# Altium schematic sheet Altium First PCB.SchDoc
size A4; SheetNumber: 1; SheetTotal: 1
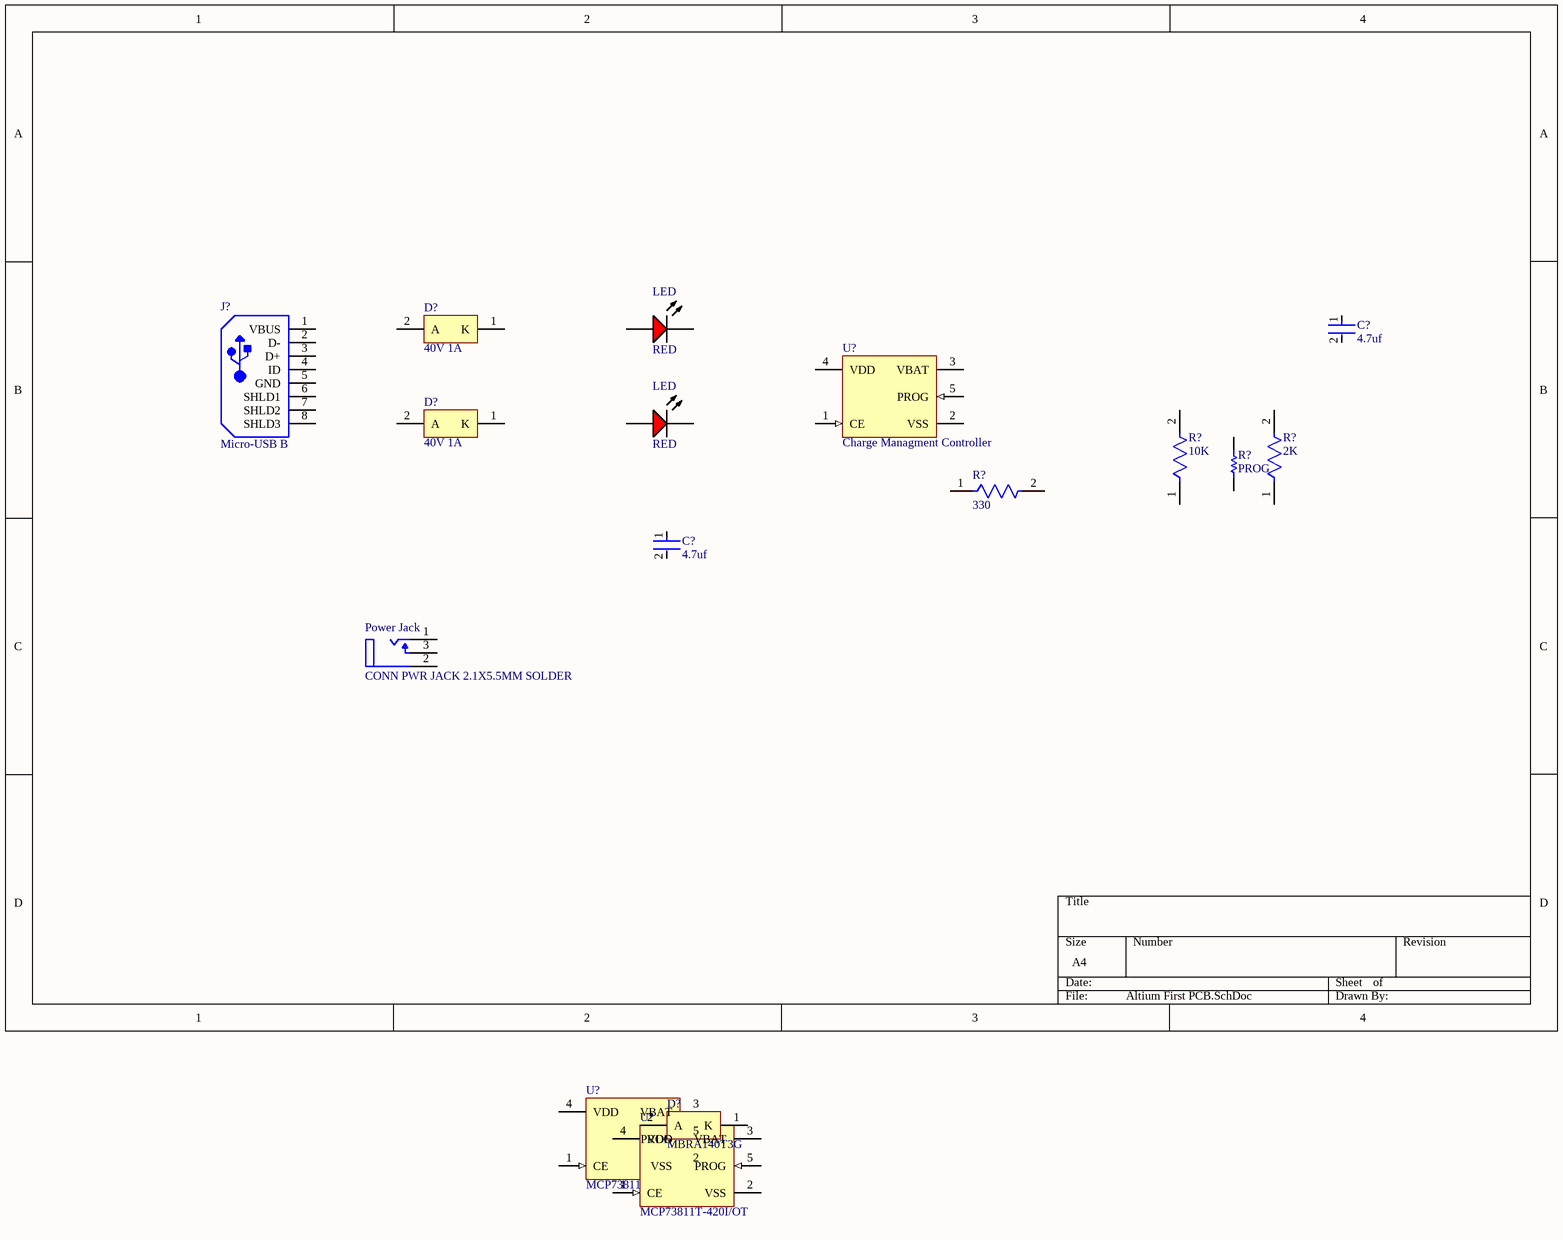
[diagram p0: Altium First PCB.SchDoc]

## Parts
(Parts that share a designator on the sheet are numbered #1, #2 ... from top to bottom, then left to right.)
C?#1  4.7uf  [FP-CC0805-0_85-MFG]
C?#2  4.7uf  [FP-CC0805-0_85-MFG]
D?#1  40V 1A  [ONSC-SMA-2-403D-02_V]
D?#2  40V 1A  [ONSC-SMA-2-403D-02_V]
D?#3  MBRA140T3G  [ONSC-SMA-2-403D-02_V]
J?  Micro-USB B  [MOLX-105133-0001_V]
LED#1  RED  [VISH-TLMS1000_V]
LED#2  RED  [VISH-TLMS1000_V]
Power_Jack  CONN PWR JACK 2.1X5.5MM SOLDER  [FP-RASM722PTR13X-MFG]
R?#1  PROG  [VISH-A1-2_V1]
R?#2  330  [FP-CRCW0805-e3-MFG]
R?#3  10K  [FP-CRCW0805-e3-IPC_C]
R?#4  2K  [FP-CRCW0805-e3-IPC_B]
U?#1  Charge Managment Controller  [SOT-23-OT5_M]
U?#2  MCP73811T-420I/OT  [SOT-23-OT5_M]
U?#3  MCP73811T-420I/OT  [SOT-23-OT5_M]

## Nets

Not connected (* = marked no-connect by the designer): C?#1 1 2; C?#2 1 2; D?#1 1(K) 2(A); D?#2 1(K) 2(A); D?#3 1(K) 2(A); J? 1(VBUS) 2(D-) 3(D+) 4(ID) 5(GND) 6(SHLD1) 7(SHLD2) 8(SHLD3); LED#1 1(A) 2(K); LED#2 1(A) 2(K); Power_Jack 1(TIP_TERMINAL(CENTER_PIN)) 2(SLEEVE_TERMINAL) 3(SHUNT_TERMINAL); R?#1 1 2; R?#2 1 2; R?#3 1 2; R?#4 1 2; U?#1 1(CE) 2(VSS) 3(VBAT) 4(VDD) 5(PROG); U?#2 1(CE) 2(VSS) 3(VBAT) 4(VDD) 5(PROG); U?#3 1(CE) 2(VSS) 3(VBAT) 4(VDD) 5(PROG)

## Library data of the parts
C?#1 C?#2 = CMP-03422-001331-1: CAP CER 4.7UF 6.3V X5R 0805; Manufacturer Part Number: CC0805KKX5R5BB475; Manufacturer: Yageo; Tolerance: 0.1; Material: Ceramic; Description: CC0805 4.7 uF X5R 10.00% 6.3 V; ComponentLink2URL: http://www.yageo.com/documents/recent/UPY-GPHC_Y5V_6.3V-to-50V_8.pdf; Octopart: https://octopart.com/cc0805kkx5r5bb475-yageo-8376548; Height: 0.95mm; Category: Cap; Ipc Land Pattern Name: CAPC200125X85; Temperature Range High: +85°C; Device Class L3: Ceramic Capacitors; Device Class L1: Passive Components; Lead Free: Yes; Temperature Characteristic: X5R; Digikey Description: CAP CER 4.7UF 6.3V X5R 0805; Footprint Url: http://www.yageo.com/exep/pages/download/literatures/UPY-C_GEN_24.pdf; Automotive: No; ComponentLink2Description: Datasheet; Temperature Range Low: -30°C; RoHS: TRUE; Value: 4.7 uF; Capacitance: 4.7 uF; Temperature: -30°C to +85°C; Mouser Description: Multilayer Ceramic Capacitors MLCC - SMD/SMT 4.7uF 6.3V X5R 10%; Package: CC0805-0.85; Device Class L2: Capacitors; Voltage Rating: 6.3 V
D?#1 D?#2 = CMP-1055-00320-1: Schottky Power Rectifier, 2-Pin SMA, Pb-Free, Tape and Reel; PartNumber: MBRA140T3G; Manufacturer: On Semiconductor; Configuration: Single; IFSM Max (A): 30; PackageReference: SMA-2-403D-02; PackageDescription: 2-Pin Small Molded Package, J-Bend Lead, Body 2.605 x 4.315 mm; RoHS: TRUE; ComponentLink1Description: Manufacturer URL; Packing: Tape and Reel; ComponentLink3URL: http://www.onsemi.com/pub_link/Collateral/403D-02.PDF; ComponentLink2Description: Datasheet; ComponentLink2URL: http://www.onsemi.cn/pub_link/Collateral/MBRA140T3-D.PDF; DatasheetVersion: Rev. 10; ComponentLink1URL: http://www.onsemi.com/; ComponentLink3Description: Package Specification; Mounting Technology: Surface Mount; PackageVersion: Rev. G, 07/2012
D?#3 = CMP-1055-00320-1: Schottky Power Rectifier, 2-Pin SMA, Pb-Free, Tape and Reel; Manufacturer: On Semiconductor; Configuration: Single; IFSM Max (A): 30; PackageReference: SMA-2-403D-02; PackageDescription: 2-Pin Small Molded Package, J-Bend Lead, Body 2.605 x 4.315 mm; RoHS: TRUE; ComponentLink1Description: Manufacturer URL; Packing: Tape and Reel; ComponentLink3URL: http://www.onsemi.com/pub_link/Collateral/403D-02.PDF; ComponentLink2Description: Datasheet; ComponentLink2URL: http://www.onsemi.cn/pub_link/Collateral/MBRA140T3-D.PDF; DatasheetVersion: Rev. 10; ComponentLink1URL: http://www.onsemi.com/; PartNumber: MBRA140T3G; ComponentLink3Description: Package Specification; Mounting Technology: Surface Mount; PackageVersion: Rev. G, 07/2012
J? = CMP-2000-05829-1: Micro-USB B Receptacle, Vertical, -30 to 85 degC, 5-Pin SMD, RoHS, Tape and Reel; Manufacturer: Molex; PartNumber: 105133-0001; Package Version: Rev. C, 11/2015; Voltage Rating: 30VAC; Connector Type: MicroUSBTypeBReceptacle; Current Rating: 1.8A; Number of Ports: 1; Voltage - Max: 30V; Mounting Style: SMD/SMT; Packaging: Reel; Product: MicroUSBTypeBConnectors; Contact Plating: Gold; Flammability Rating: UL94V-0; Package Description: 5-Pin Surface Mount Device, Pitch 0.65 mm; Package Reference: 105133-0001; Contact Material: CopperAlloy; Mounting Angle: Vertical; RoHS: Details; Manufacturer URL: http://www.molex.com/; Factory Pack Quantity: 6000; Standard: USB; Brand: Molex; Series: 105133; Product Category: USBConnectors; Termination Style: SolderTail; Gender: Receptacle; Package URL: http://www.molex.com/pdm_docs/sd/1051330001_sd.pdf; Datasheet Version: 03/2016; Color: Black; Datasheet URL: http://www.molex.com/webdocs/datasheets/pdf/en-us/1051330001_IO_CONNECTORS.pdf; Mounting Technology: SurfaceMount
LED#1 LED#2 = CMP-2000-07254-1: Low Current LED, 40 mW, 1.8 V, -40 to 100 degC, 2-Pin SMD (0603), RoHS, Tape and Reel; Manufacturer: Vishay; Lens Shape: Rectangular; Automotive Qualification Standard: AEC-Q100; Wavelength Typ: 636nm; SVHC: ToBeAdvised; Bulb Size: 1.6mmx0.8mm; Forward Voltage: 1.8V; Luminous Intensity: 4mcd; Forward Current If: 2mA; Viewing Angle: 80°; Datasheet Version: Rev. 1.7, 02/2011; Datasheet URL: https://datasheet.ciiva.com/5798/1698881-5798337.pdf; LED Mounting: SMD; Packaging: CutTape; Package Reference: TLMS1000; Manufacturer URL: http://www.vishay.com/; Mounting Technology: SurfaceMount; Product Range: -; LED Colour: Red; Package Description: 2-Pin Surface Mount Device, Body 1.6 x 0.8 mm; MSL: MSL2-1year
Power_Jack = CMP-47995-000002-1: Shielding: Unshielded; Gender: Male; Current Rating: 5A; Termination: Solder; Contact Material: Copper Alloy; Package Quantity: 120; Case/Package: SMD/SMT; Contact Plating: Tin; Connector Type: Jack; Housing Material: Thermoplastic; Mount: Surface Mount; Housing Color: Black; Color: Black
R?#1 = CMP-1240-00001-1: Power Metal Film Leaded Resistor, 62 KOhm +/-5%, 2 W, 2-Pin THD, RoHS, Ammo Pack; PartNumber: PR02000206202JA100; Manufacturer: Vishay Semiconductor; Resistance: 62 KOhm; Temperature Coefficient: +/-250 ppm/degC; Power: 2 W; ComponentLink2URL: http://www.vishay.com/docs/28729/28729.pdf; Mounting Technology: Through Hole; Tolerance: +/-5%; ComponentLink3Description: Package Specification; ComponentLink3URL: http://www.vishay.com/docs/28729/28729.pdf; ComponentLink1Description: Manufacturer URL; ComponentLink2Description: Datasheet; DatasheetVersion: Jun-13; PackageDescription: 2-Pin Axial Lead, Body 10 x 3.9 mm; ComponentLink1URL: http://www.vishay.com/; Packing: Ammo Pack; RoHS: TRUE
R?#2 = CMP-2001-03823-2: RES Thick Film, 330Ω, 1%, 0.125W, 100ppm/°C, 0805; Voltage Rating (DC): 150V; Resistance: 330R; Max Power Dissipation: 125mW; Mount: Surface Mount; Packaging: Tape and Reel; Min Operating Temperature: -55°C; Military Standard: Not; Case Code (Metric): 2012; Height: 0.02inch; Voltage Rating: 150V; Case/Package: 0805; Max Operating Temperature: 155°C; Width: 0.049inch; Case Code (Imperial): 0805; Termination: SMD/SMT; Lead Free: Lead Free; Contact Plating: Tin; Package Quantity: 10; Composition: Thick Film; Length: 2mm; Features: Automotive AEC-Q200; Depth: 1.25mm; Weight: 0.000194oz; Tolerance: 1%; Power Rating: 125mW; Number of Terminations: 2; Temperature Coefficient: 100ppm/°C
R?#3 = CMP-2001-04910-2: RES Thick Film, 10kΩ, 5%, 0.125W, 200ppm/°C, 0805; Voltage Rating: 150V; Resistance: 10kR; Power Rating: 125mW; Composition: Thick Film; Termination: SMD/SMT; Case Code (Imperial): 0805; Temperature Coefficient: 200ppm/°C; Contact Plating: Tin; Tolerance: 5%; Military Standard: Not; Height: 0.45mm; Weight: 0.000194oz; Length: 2mm; Packaging: Tape and Reel; Mount: Surface Mount; Width: 1.25mm; Depth: 1.25mm; Voltage Rating (DC): 150V; Lead Free: Lead Free; Case/Package: 0805; Radiation Hardening: No; Max Operating Temperature: 155°C; Min Operating Temperature: -55°C; Case Code (Metric): 2012; Package Quantity: 5000
R?#4 = CMP-2001-03755-2: RES Thick Film, 2kΩ, 1%, 0.125W, 100ppm/°C, 0805; Working Voltage: 150V; Max Power Dissipation: 125mW; Resistance: 2kR; Package Quantity: 10; Case Code (Metric): 2012; Voltage Rating: 150V; Number of Terminations: 2; Max Operating Temperature: 155°C; Depth: 1.25mm; Tolerance: 1%; Power Rating: 125mW; Lead Free: Lead Free; Case/Package: 0805; Features: Automotive AEC-Q200; Min Operating Temperature: -55°C; Termination: SMD/SMT; Case Code (Imperial): 0805; Weight: 0.000194oz; Packaging: Tape and Reel; Military Standard: Not; Radiation Hardening: No; Contact Plating: Tin; Mount: Surface Mount; Temperature Coefficient: 100ppm/°C; Height: 0.02inch; Number of Terminals: 2; Voltage Rating (DC): 150V; Number of Pins: 2; Length: 2mm; Width: 1.25mm; Composition: Thick Film
U?#1-U?#3 = CMP-0133-00139-1: Simple, Miniature Single-Cell, Fully Integrated Li-Ion/Li-Polymer Charge Management Controller, 4.2V, 5-Pin SOT-23, Industrial Temperature, Tape and Reel; Code_IPC: SOT23-5; PackageDescription: 5-Lead Plastic Small Outline Transistor (OT) [SOT-23]; PackageVersion: revBB, Aug-2009; DatasheetVersion: revB, Sep-2007; PackageReference: SOT-23-OT5